# Altium schematic sheet alarm_clock_devkit_usb_power.SchDoc
size 290 x 209 mm
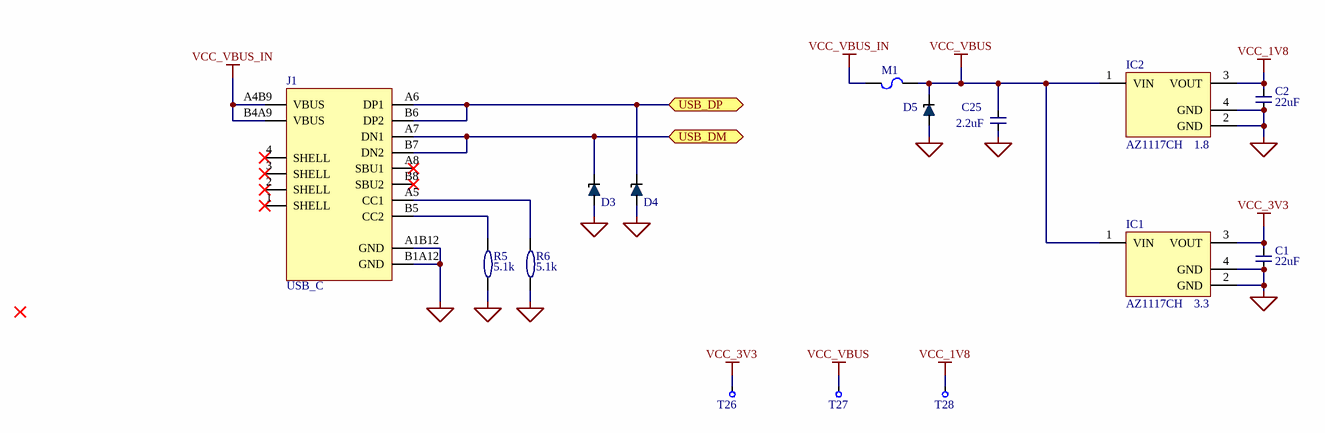
[diagram p0: alarm_clock_devkit_usb_power.SchDoc]

## Parts
C1  22uF  [CAP 0805_2012]
C2  22uF  [CAP 0805_2012]
C25  2.2uF  [CAP 0805_2012]
D3  TVS_DIODE  [SODFL98X40-2L]  (value not drawn)
D4  TVS_DIODE  [SODFL98X40-2L]  (value not drawn)
D5  TVS_DIODE  [SODFL98X40-2L]  (value not drawn)
IC1  AZ1117CH  VOUT: 3.3  [SOT230P700X180-4N]
IC2  AZ1117CH  VOUT: 1.8  [SOT230P700X180-4N]
J1  USB_C  [USB-C-SMD_G-SWITCH_GT-USB-7010ASV]
M1  FUSE  [FUSE 0603_1608 0.5MM]  (value not drawn)
R5  5.1k  [RES 0603_1608]
R6  5.1k  [RES 0603_1608]
T26  TESTPOINT  [TESTPOINT_1MM]  (value not drawn)
T27  TESTPOINT  [TESTPOINT_1MM]  (value not drawn)
T28  TESTPOINT  [TESTPOINT_1MM]  (value not drawn)

## Ports
USB_DM (bidir), USB_DP (bidir)

## Nets
GND: C1.1(A) C2.1(A) C25.1(A) D3.2(A) D4.2(A) D5.2(A) IC1.2(GND) IC1.4(GND) IC2.2(GND) IC2.4(GND) J1.A1B12(GND) J1.B1A12(GND) R5.1(A) R6.1(A)
VCC_1V8: C2.2(B) IC2.3(VOUT) T28.1
VCC_3V3: C1.2(B) IC1.3(VOUT) T26.1
VCC_VBUS: C25.2(B) D5.1(K) IC1.1(VIN) IC2.1(VIN) M1.2 T27.1
VCC_VBUS_IN: J1.A4B9(VBUS) J1.B4A9(VBUS) M1.1
USB_DM: D3.1(K) J1.A7(DN1) J1.B7(DN2) ; port USB_DM
USB_DP: D4.1(K) J1.A6(DP1) J1.B6(DP2) ; port USB_DP
NetJ1_A5: J1.A5(CC1) R6.2(B)
NetJ1_B5: J1.B5(CC2) R5.2(B)

Not connected (* = marked no-connect by the designer): J1 1(SHELL)* 2(SHELL)* 3(SHELL)* 4(SHELL)* A8(SBU1)* B8(SBU2)*

## Library data of the parts
C1 C2 C25 = CAP_CERAMIC: MLCC; LCSC Part Number: *; Tolerance: *; Voltage: *; Package: *; Dielectric: *
  C1 C2: Value: 22uF
  C25: Value: 2.2uF
R5 R6 = RESISTOR: Value: 5.1k; LCSC Part Number: *; Tolerance: *; Package: *; Power: *